# EAGLE design tgs2611-c00-v2.brd (EAGLE 9.6.2)
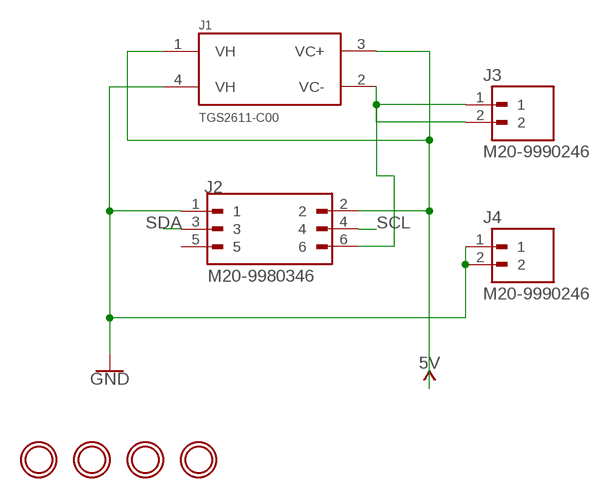
[diagram p0: schematic, sheet 1]

## Parts
J1  TGS2611-C00  [TO180P920X780-4P]
J2  M20-9980346  [HARWIN_M20-9980346]
J3  M20-9990246  [HARWIN_M20-9990246]
J4  M20-9990246  [HARWIN_M20-9990246]
U$1  MOUNTINGHOLE2.5  [MOUNTINGHOLE_2.5_PLATED]
U$2  MOUNTINGHOLE2.5  [MOUNTINGHOLE_2.5_PLATED]
U$3  MOUNTINGHOLE2.5  [MOUNTINGHOLE_2.5_PLATED]
U$4  MOUNTINGHOLE2.5  [MOUNTINGHOLE_2.5_PLATED]

## Nets
5V: J1.1(VH) J1.3(VC+) J2.2
GND: J1.4(VH) J2.1 J4.1 J4.2
N$1: J1.2(VC-) J2.6 J3.1 J3.2
SCL: J2.4
SDA: J2.3
Unconnected: J2.5

## Library data of the parts
J1 = TGS2611-C00:TGS2611-C00: Methane, Natural Gas sensor, Check availability <https://pricing.snapeda.com/parts/TGS2611-C00/Figaro/view-part?ref=eda>; AVAILABILITY: Not in stock; CHECK_PRICES: https://www.snapeda.com/parts/TGS2611-C00/Figaro/view-part/?ref=eda; DESCRIPTION: Gas Sensor 4-Pin TO-5; MF: Figaro; MP: TGS2611-C00; PACKAGE: None; PRICE: None; SNAPEDA_LINK: https://www.snapeda.com/parts/TGS2611-C00/Figaro/view-part/?ref=snap
J2 = M20-9980346:M20-9980346; MANUFACTURER: HARWIN; STANDARD: Manufacturer Recommendations
J3 J4 = M20-9990246:M20-9990246; MANUFACTURER: Harwin; MAXIMUM_PACKAGE_HEIGHT: 9.64mm; PARTREV: 14; STANDARD: Manufacturer Recommendations
U$1-U$4 = microbuilder:MOUNTINGHOLE: Mounting Hole For #2 screws (0.086"/2.18mm width, 0.094"/2.4mm hole) use 2.5mm

## Board
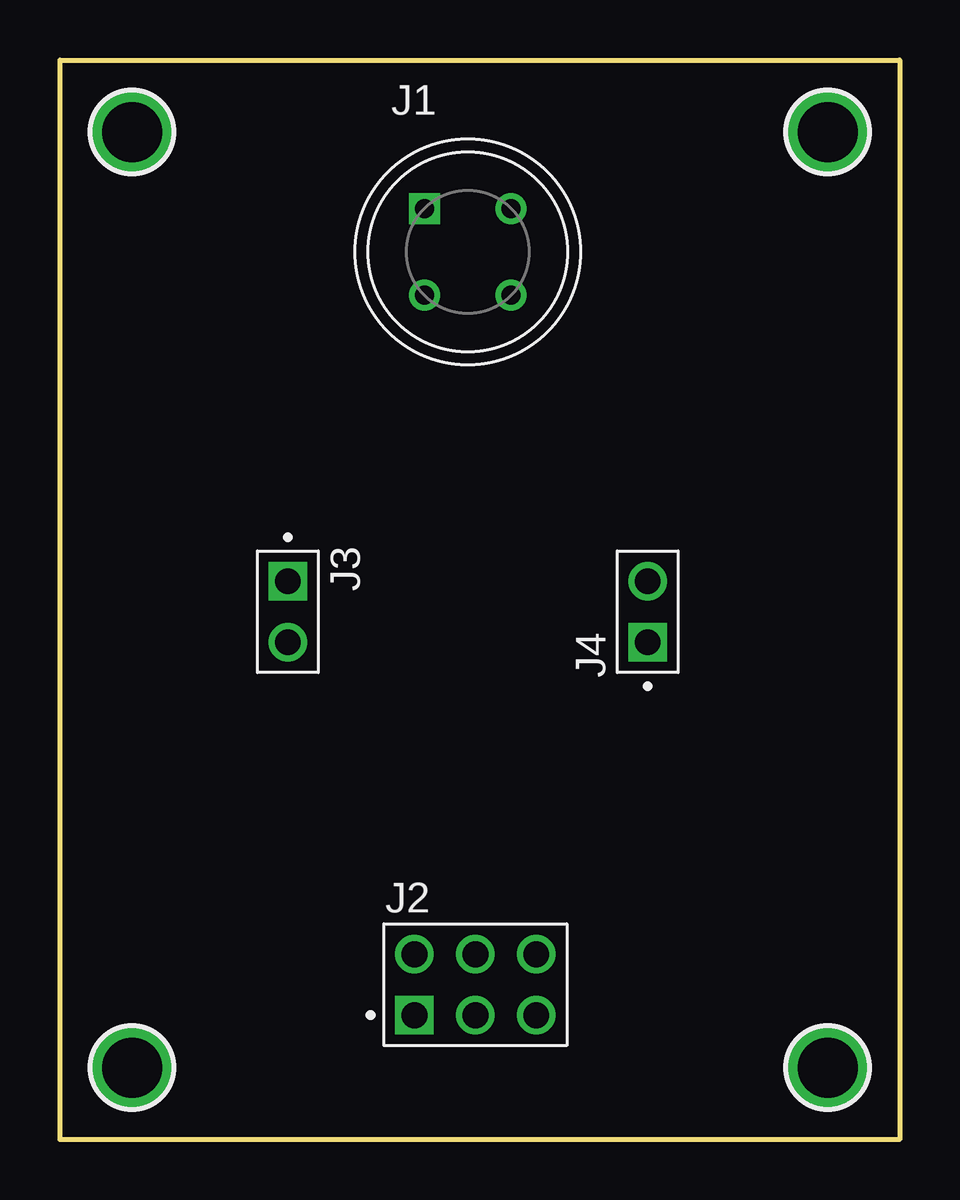
[diagram p1: board, top side]
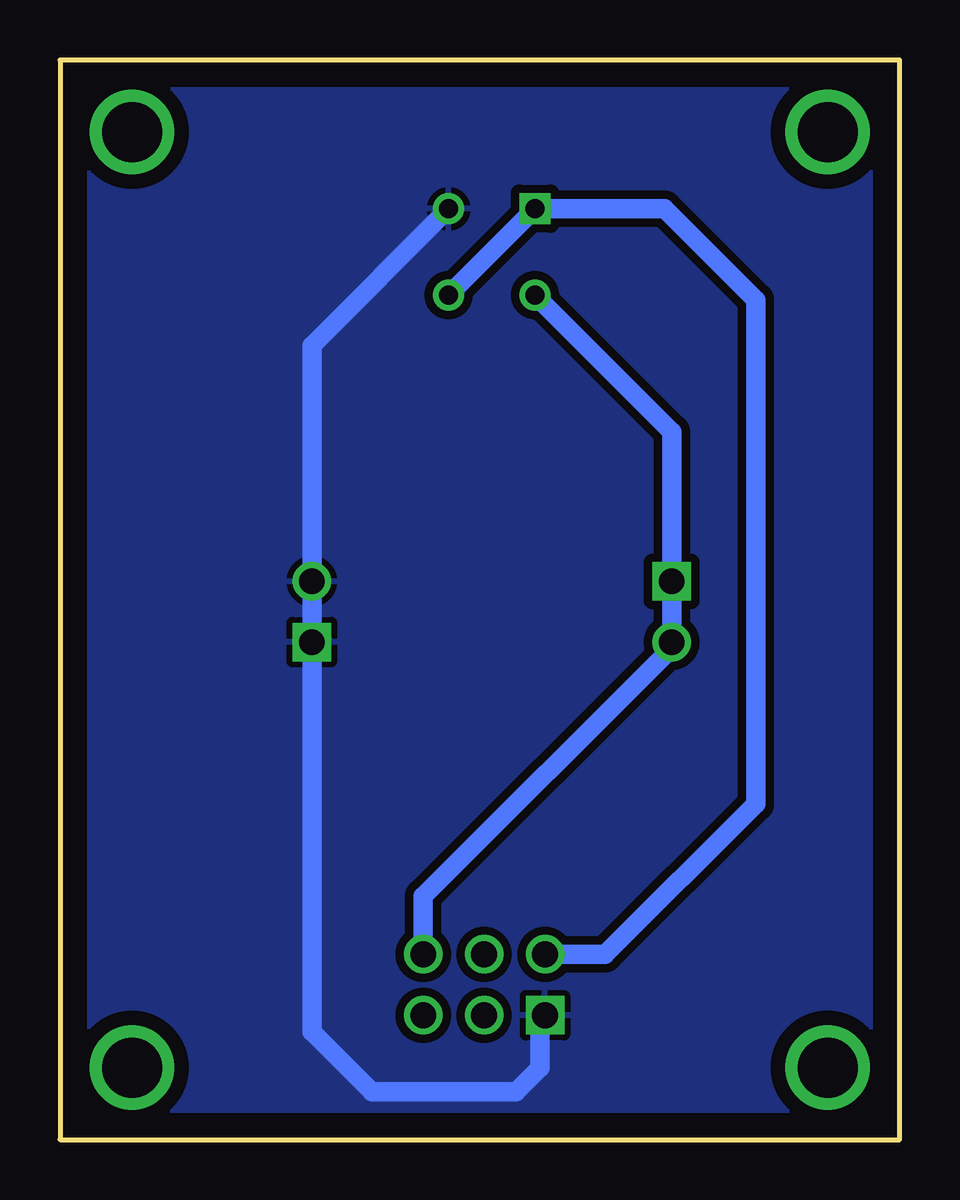
[diagram p2: board, bottom side, seen from below]

Size 35 x 45 mm. Coordinates in mm from the lower left corner, seen from the top.
Outline: 0,45 35,45 35,0 0,0 0,45
Copper layers (1*16): Top 0.035mm / dielectric 1.5mm / Bottom 0.035mm
Design rules "default": minimum track width 6mil, minimum drill 0.35mm, track to track 6mil, track to pad 6mil, pad to pad 6mil, via to via 6mil, smd to smd 6mil, copper to edge 40mil, drill to drill 6mil, minimum pad ring 10mil, minimum via ring 8mil, stop-mask expansion 4mil, vias tented up to drill 0mil, thermal gap 10mil

### Footprints (pad centres in the part's own frame; a part is rotated, then mirrored left to right if it is on the bottom)
TO180P920X780-4P = drill 0.8 square: 1 -1.8,1.8 | drill 0.8: 2 -1.8,-1.8; 3 1.8,-1.8; 4 1.8,1.8
HARWIN_M20-9980346 = drill 1.07 square: 1 -2.54,-1.27 | drill 1.07: 2 -2.54,1.27; 3 0,-1.27; 4 0,1.27; 5 2.54,-1.27; 6 2.54,1.27
HARWIN_M20-9990246 = drill 1.07 square: 1 -1.27,0 | drill 1.07: 2 1.27,0
MOUNTINGHOLE_2.5_PLATED = drill 2.5 pad 3.2: P$1 0,0

### Placement (x,y rotation side)
J1  17,37 0 top
J2  17.32,6.45 0 top
J3  9.5,22 270 top
J4  24.5,22 90 top
U$1  32,3 0 top
U$2  3,3 0 top
U$3  32,42 0 top
U$4  3,42 0 top

### Tracks (layer width: path | path; a pad name or v marks a point on that pad's centre or on a via)
5V
  Bottom 0.813: J2.2 12.28,7.72 6,14 6,35 9.8,38.8 J1.1 J1.3
GND
  Bottom 0.813: J2.1 15,4.96 15,3 16,2 22,2 24.5,4.5 J4.1 J4.2 24.5,33.1 J1.4
  pour Bottom (isolate 0.35): 1,44 34,44 34,1 1,1
N$1
  Bottom 0.813: J2.6 19.86,10.14 9.5,20.5 J3.2 J3.1 9.5,29.5 J1.2